# EAGLE design Flex2019V1 (EAGLE 9.2.2)
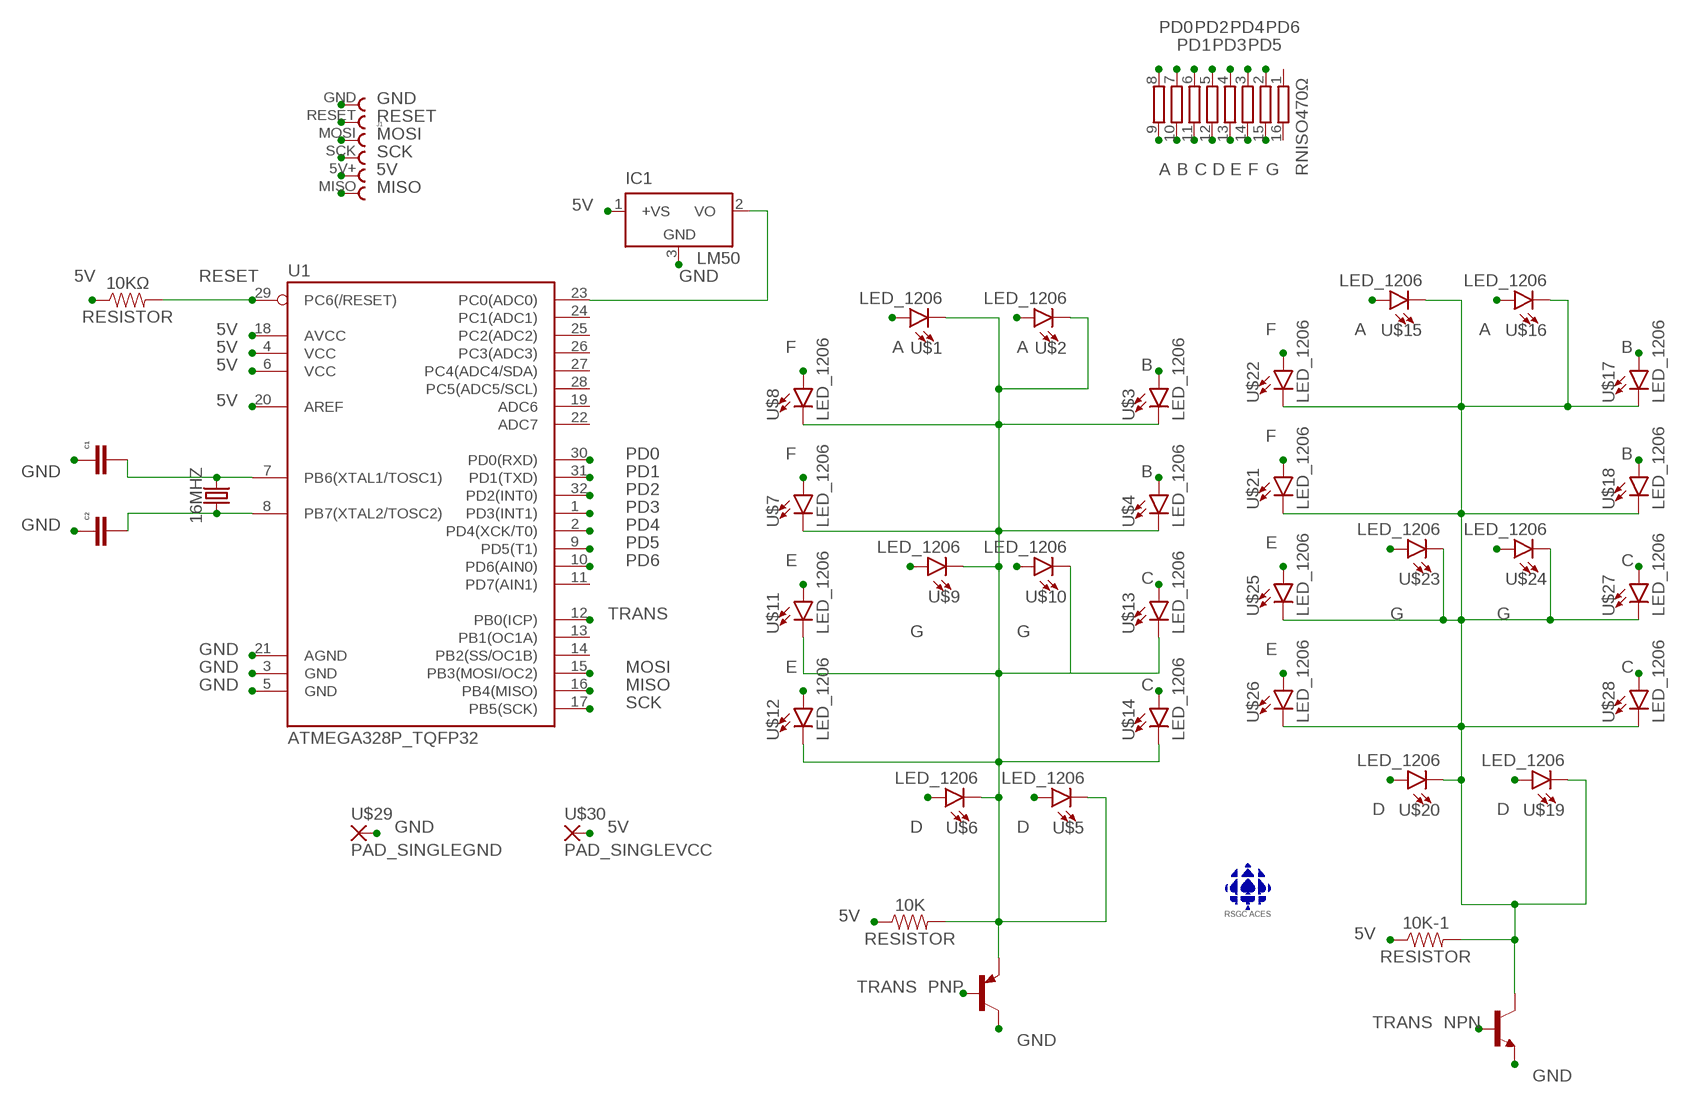
[diagram p0: schematic, sheet 1]

## Parts
10K  RESISTOR  [R1206]
10K-1  RESISTOR  [R1206]
10KΩ  RESISTOR  [R1206]
16MHZ  CRYSTALSMD-5X3.2-2PAD  [CRYSTAL-SMD-5X3.2-2PAD]
C1  CAPACITOR_1206_NONPPOLAR  [C1206]
C2  CAPACITOR_1206_NONPPOLAR  [C1206]
IC1  LM50  [SOT23]
J1  CONN_FPC_ISPCONNECTOR_PADS  [68610614122]
NPN  -NPN-SOT23-BEC  [SOT23-BEC]
PNP  -PNP-SOT23-BEC  [SOT23-BEC]
RNISO470Ω  RESISTOR_NETWORK  [4816P]
U1  ATMEGA328P_TQFP32  [TQFP32-08]
U$1  LED_1206  [CHIPLED_1206]
U$2  LED_1206  [CHIPLED_1206]
U$3  LED_1206  [CHIPLED_1206]
U$4  LED_1206  [CHIPLED_1206]
U$5  LED_1206  [CHIPLED_1206]
U$6  LED_1206  [CHIPLED_1206]
U$7  LED_1206  [CHIPLED_1206]
U$8  LED_1206  [CHIPLED_1206]
U$9  LED_1206  [CHIPLED_1206]
U$10  LED_1206  [CHIPLED_1206]
U$11  LED_1206  [CHIPLED_1206]
U$12  LED_1206  [CHIPLED_1206]
U$13  LED_1206  [CHIPLED_1206]
U$14  LED_1206  [CHIPLED_1206]
U$15  LED_1206  [CHIPLED_1206]
U$16  LED_1206  [CHIPLED_1206]
U$17  LED_1206  [CHIPLED_1206]
U$18  LED_1206  [CHIPLED_1206]
U$19  LED_1206  [CHIPLED_1206]
U$20  LED_1206  [CHIPLED_1206]
U$21  LED_1206  [CHIPLED_1206]
U$22  LED_1206  [CHIPLED_1206]
U$23  LED_1206  [CHIPLED_1206]
U$24  LED_1206  [CHIPLED_1206]
U$25  LED_1206  [CHIPLED_1206]
U$26  LED_1206  [CHIPLED_1206]
U$27  LED_1206  [CHIPLED_1206]
U$28  LED_1206  [CHIPLED_1206]
U$29  PAD_SINGLEGND  [PAD_GND]
U$30  PAD_SINGLEVCC  [PAD_VCC]
U$31  ACES_LOGO  [ACES_LOGO]

## Nets
5V: 10K-1.1 10K.1 10KΩ.1 IC1.1(+VS) J1.5V+ U1.4(VCC) U1.6(VCC) U1.18(AVCC) U1.20(AREF) U$30.1(P)
A: RNISO470Ω.9 U$1.A U$2.A U$15.A U$16.A
B: RNISO470Ω.10 U$3.A U$4.A U$17.A U$18.A
C: RNISO470Ω.11 U$13.A U$14.A U$27.A U$28.A
D: RNISO470Ω.12 U$5.A U$6.A U$19.A U$20.A
E: RNISO470Ω.13 U$11.A U$12.A U$25.A U$26.A
F: RNISO470Ω.14 U$7.A U$8.A U$21.A U$22.A
G: RNISO470Ω.15 U$9.A U$10.A U$23.A U$24.A
GND: C1.1 C2.1 IC1.3(GND) J1.GND NPN.E PNP.C U1.3(GND) U1.5(GND) U1.21(AGND) U$29.1(P)
MISO: J1.MISO U1.16(PB4(MISO))
MOSI: J1.MOSI U1.15(PB3(MOSI/OC2))
N$1: IC1.2(VO) U1.23(PC0(ADC0))
N$2: 16MHZ.P$2 C1.2 U1.7(PB6(XTAL1/TOSC1))
N$3: 16MHZ.P$1 C2.2 U1.8(PB7(XTAL2/TOSC2))
N$4: 10K.2 PNP.E U$1.C U$2.C U$3.C U$4.C U$5.C U$6.C U$7.C U$8.C U$9.C U$10.C U$11.C U$12.C U$13.C U$14.C
N$5: 10K-1.2 NPN.C U$15.C U$16.C U$17.C U$18.C U$19.C U$20.C U$21.C U$22.C U$23.C U$24.C U$25.C U$26.C U$27.C U$28.C
PD0: RNISO470Ω.8 U1.30(PD0(RXD))
PD1: RNISO470Ω.7 U1.31(PD1(TXD))
PD2: RNISO470Ω.6 U1.32(PD2(INT0))
PD3: RNISO470Ω.5 U1.1(PD3(INT1))
PD4: RNISO470Ω.4 U1.2(PD4(XCK/T0))
PD5: RNISO470Ω.3 U1.9(PD5(T1))
PD6: RNISO470Ω.2 U1.10(PD6(AIN0))
RESET: 10KΩ.2 J1.RESET U1.29(PC6(/RESET))
SCK: J1.SCK U1.17(PB5(SCK))
TRANS: NPN.B PNP.B U1.12(PB0(ICP))
Unconnected: RNISO470Ω.1 RNISO470Ω.16 U1.11(PD7(AIN1)) U1.13(PB1(OC1A)) U1.14(PB2(SS/OC1B)) U1.19(ADC6) U1.22(ADC7) U1.24(PC1(ADC1)) U1.25(PC2(ADC2)) U1.26(PC3(ADC3)) U1.27(PC4(ADC4/SDA)) U1.28(PC5(ADC5/SCL))

## Library data of the parts
10K 10K-1 10KΩ = ACES_SMT:RESISTOR
16MHZ = SparkFun-Clocks:CRYSTAL: Crystals (Generic) These are passive quartz crystals, which can be used as a clock source for a microcontroller. Crystal's are two-terminal devices. They require external "load" capacitors to generate an oscillating signal.
C1 C2 = ACES_SMT:CAPACITOR_1206_NONPPOLAR
IC1 = linear:LM50: SOT-23 Single-Supply Centigrade Temperature Sensor Vout = (10mV/°C x Temp °C) +5mmmV Source: http://cache.national.com/ds/LM/LM50.pdf
J1 = ACES_SMT:CONN_FPC_ISP: WR-FPC 1.00mm SMT ZIF Horizontal Top Contact, 6 Pins=>Code : Con_FPC_ZIF_1.00_68610614122 <http://katalog.we-online.de/media/images/eican/Con_FPC_ZIF_1.00_6861xx14122_pf2.jpg> Details see: http://katalog.we-online.de/en/em/686_1xx_141_22 Created 2014-07-09, Karrer Zheng 2014 (C) Würth Elektronik
NPN = DC_LOAD_AU:*-NPN-: NPN Transistror BF959 corrected 2008.03.06
PNP = DC_LOAD_AU:*-PNP-: PNP Transistror
RNISO470Ω = ACES_SMT:RESISTOR_NETWORK: BOURNS RESISTOR NETWORK; MF: BOURNS, INC.; MPN: 4816P-T01-684LF; OC_FARNELL: 9357483; OC_NEWARK: 33K0707
U1 = ACES_SMT:ATMEGA328P_TQFP32: Popular 328P in QFP Storefront component: ATmega328 - TQFP <https://www.sparkfun.com/products/13448> (COM-13448) Datasheet <http://www.sparkfun.com/datasheets/Components/SMD/ATMega328.pdf> SparkFun Products SparkFun RedBoard - Programmed with Arduino <https://www.sparkfun.com/products/12757> (DEV-12757) Arduino Pro Mini 328 - 5V/16MHz <https://www.sparkfun.com/products/11113> (DEV-11113) Arduino Pro Mini 328 - 3.3V/8MHz <https://www.sparkfun.com/products/11114> (DEV-11114) SparkFun OpenLog <https://www.sparkfun.com/products/13712> (DEV-13712) SparkFun MicroView - OLED Arduino Module <https://www.sparkfun.com/products/12923> (DEV-12923) SparkFun Digital Sandbox <https://www.sparkfun.com/products/12651> (DEV-12651) SparkFun PicoBoard <https://www.sparkfun.com/products/11888> (WIG-11888) Arduino Fio <https://www.sparkfun.com/products/10116> (DEV-10116) LilyPad Arduino 328 Main Board <https://www.sparkfun.com/products/13342> (DEV-13342) SparkFun RedStick <https://www.sparkfun.com/products/13741> (DEV-13741) LilyPad MP3 <https://www.sparkfun.com/products/11013> (DEV-11013) LilyPad Arduino SimpleSnap <https://www.sparkfun.com/products/10941> (DEV-10941) SparkFun Stepoko <https://www.sparkfun.com/products/13899> (ROB-13899) SparkFun Geiger Counter <https://www.sparkfun.com/products/11345> (SEN-11345) SparkFun EL Sequencer <https://www.sparkfun.com/products/12781> (COM-12781) Arduino Pro 328 - 5V/16MHz <https://www.sparkfun.com/products/10915> (DEV-10915) CryptoCape <https://www.sparkfun.com/products/12773> (DEV-12773) SparkFun IR Thermometer Evaluation Board - MLX90614 <https://www.sparkfun.com/products/10740> (SEN-10740) SparkFun RedBot Mainboard <https://www.sparkfun.com/products/12097> (ROB-12097) Arduino Pro 328 - 3.3V/8MHz <https://www.sparkfun.com/products/10914> (DEV-10914) SparkFun Block for Intel® Edison - Arduino <https://www.sparkfun.com/products/13036> (DEV-13036) SparkFun Simon Says - Surface Mount Soldering Kit <https://www.sparkfun.com/products/10935> (KIT-10935) SparkFun 7-Segment Serial Display - Red <https://www.sparkfun.com/products/11441> (COM-11441) SparkFun 7-Segment Serial Display - White <https://www.sparkfun.com/products/11629> (COM-11629) SparkFun 7-Segment Serial Display - Yellow <https://www.sparkfun.com/products/11443> (COM-11443) SparkFun 7-Segment Serial Display - Kelly Green <https://www.sparkfun.com/products/11440> (COM-11440) SparkFun 7-Segment Serial Display - Blue <https://www.sparkfun.com/products/11442> (COM-11442) SparkFun OpenSegment Serial Display - 20mm (Blue) <https://www.sparkfun.com/products/11647> (COM-11647) SparkFun OpenSegment Serial Display - 20mm (Green) <https://www.sparkfun.com/products/11646> (COM-11646) SparkFun OpenSegment Serial Display - 20mm (White) <https://www.sparkfun.com/products/11648> (COM-11648) SparkFun OpenSegment Serial Display - 20mm (Red) <https://www.sparkfun.com/products/11644> (COM-11644) SparkFun OpenSegment Serial Display - 20mm (Yellow) <https://www.sparkfun.com/products/11645> (COM-11645) SparkFun OpenSegment Shield <https://www.sparkfun.com/products/13190> (DEV-13190)
U$1-U$28 = ACES_SMT:LED_1206
U$29 U$30 = ACES_SMT:PAD_SINGLE
U$31 = ACES_SMT:ACES_LOGO

## Board
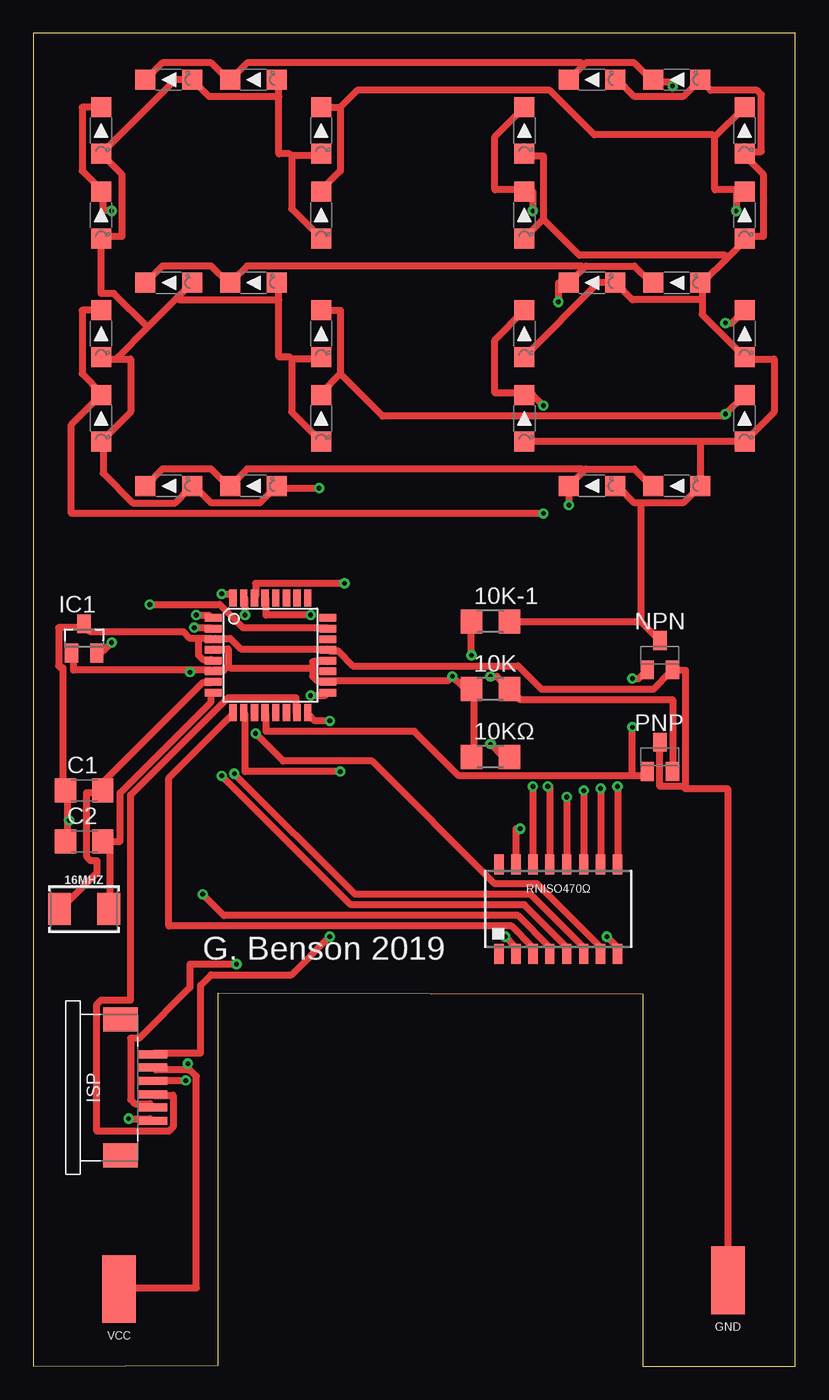
[diagram p1: board, top side]
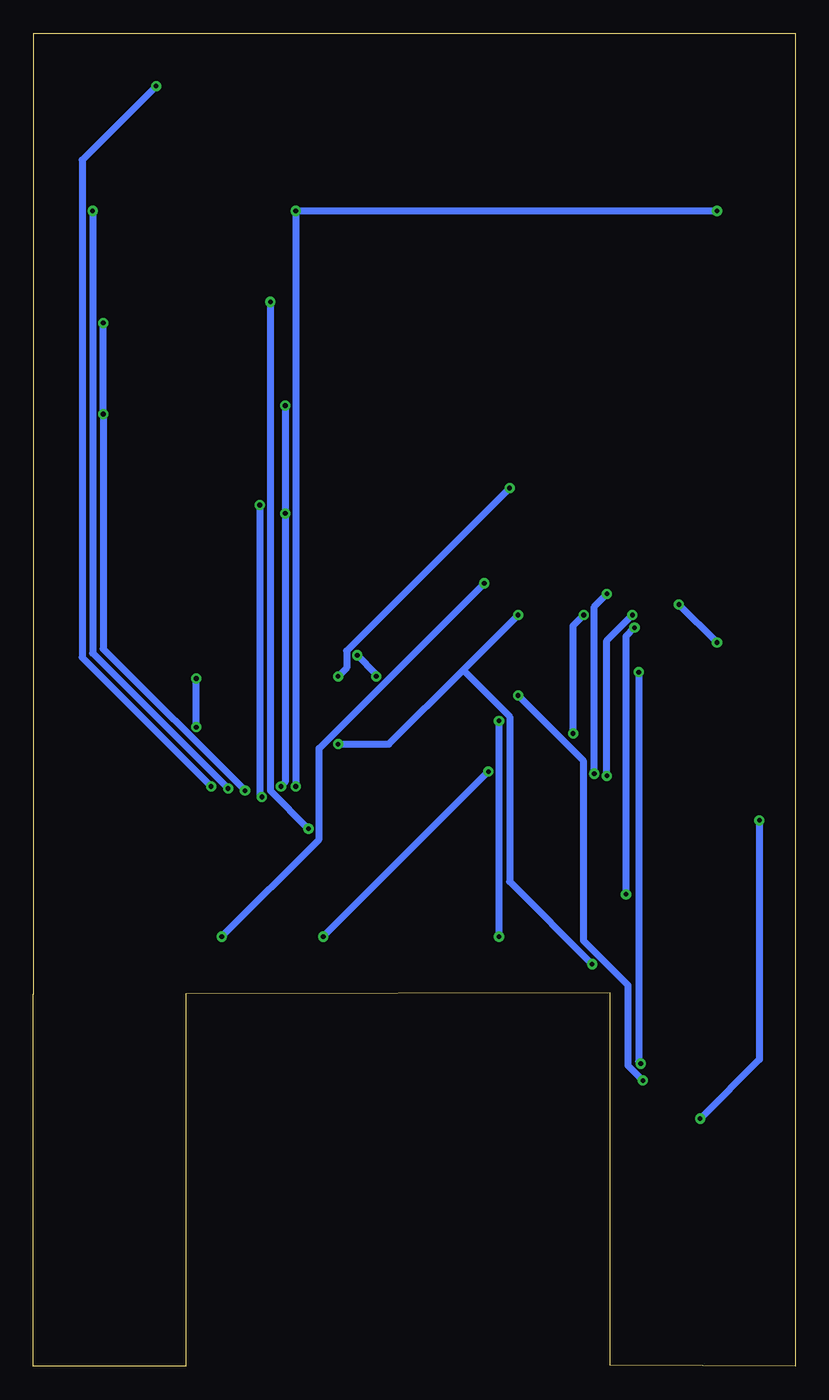
[diagram p2: board, bottom side, seen from below]

Size 57.15 x 100 mm. Coordinates in mm from the lower left corner, seen from the top.
Outline: 0,100 0,0 13.87,0.08 13.87,28.02 45.72,27.94 45.72,0 57.15,0 57.15,27.94 57.13,27.94 57.13,100 0,100
Copper layers (1*16): Top 0.035mm / dielectric 1.5mm / Bottom 0.035mm
Design rules "default *": minimum track width 20mil, minimum drill 0.35mm, track to track 6mil, track to pad 6mil, pad to pad 6mil, via to via 6mil, smd to smd 6mil, copper to edge 40mil, drill to drill 6mil, minimum pad ring 10mil, minimum via ring 8mil, stop-mask expansion 4mil, vias tented up to drill 0mil, thermal gap 10mil

### Footprints (pad centres in the part's own frame; a part is rotated, then mirrored left to right if it is on the bottom)
R1206 = smd 1.6 x 1.803: 1 -1.422,0; 2 1.422,0
CRYSTAL-SMD-5X3.2-2PAD = smd 1.7 x 2.4: P$1 1.85,0; P$2 -1.85,0
C1206 = smd 1.6 x 1.8: 1 -1.4,0; 2 1.4,0
SOT23 = smd 1 x 1.4: 1 -0.95,-1.1; 2 0.95,-1.1; 3 0,1.1
68610614122 = smd 2.2 x 0.6: 5V+ -2.4,-1.5; GND -2.4,2.5; MISO -2.4,-2.5; MOSI -2.4,0.5; RESET -2.4,1.5; SCK -2.4,-0.5 | smd 2.6 x 1.8: Z1 0,-5.1; Z2 0,5.1
SOT23-BEC = smd 1 x 1.4: B -0.95,-1.1; C 0,1.1; E 0.95,-1.1
4816P = smd 0.7 x 1.5: 1 -4.445,-3.346; 2 -3.175,-3.346; 3 -1.905,-3.346; 4 -0.635,-3.346; 5 0.635,-3.346; 6 1.905,-3.346; 7 3.175,-3.346; 8 4.445,-3.346; 9 4.445,3.346; 10 3.175,3.346; 11 1.905,3.346; 12 0.635,3.346; 13 -0.635,3.346; 14 -1.905,3.346; 15 -3.175,3.346; 16 -4.445,3.346
TQFP32-08 = smd 1.27 x 0.559: 1 -4.293,2.8; 2 -4.293,2; 3 -4.293,1.2; 4 -4.293,0.4; 5 -4.293,-0.4; 6 -4.293,-1.2; 7 -4.293,-2; 8 -4.293,-2.8; 17 4.293,-2.8; 18 4.293,-2; 19 4.293,-1.2; 20 4.293,-0.4; 21 4.293,0.4; 22 4.293,1.2; 23 4.293,2; 24 4.293,2.8 | smd 0.559 x 1.27: 9 -2.8,-4.293; 10 -2,-4.293; 11 -1.2,-4.293; 12 -0.4,-4.293; 13 0.4,-4.293; 14 1.2,-4.293; 15 2,-4.293; 16 2.8,-4.293; 25 2.8,4.293; 26 2,4.293; 27 1.2,4.293; 28 0.4,4.293; 29 -0.4,4.293; 30 -1.2,4.293; 31 -2,4.293; 32 -2.8,4.293
CHIPLED_1206 = smd 1.5 x 1.5: A 1.75,0; C -1.75,0
PAD_GND = smd 2.54 x 5.08: 1 0,0
PAD_VCC = smd 2.54 x 5.08: 1 0,0

### Placement (x,y rotation side)
10K  34.29,50.8 0 top
10K-1  34.29,55.88 0 top
10KΩ  34.29,45.72 0 top
16MHZ  3.81,34.29 0 top
C1  3.81,43.18 0 top
C2  3.81,39.37 0 top
IC1  3.81,54.61 0 top
J1  6.53,20.9 180 top
NPN  46.99,53.34 0 top
PNP  46.99,45.72 0 top
RNISO470Ω  39.37,34.29 0 top
U1  17.78,53.34 0 top
U$1  10.16,96.52 180 top
U$2  16.51,96.52 180 top
U$3  21.59,92.71 90 top
U$4  21.59,86.36 90 top
U$5  16.51,66.04 180 top
U$6  10.16,66.04 180 top
U$7  5.08,86.36 90 top
U$8  5.08,92.71 90 top
U$9  10.16,81.28 180 top
U$10  16.51,81.28 180 top
U$11  5.08,77.47 90 top
U$12  5.08,71.12 90 top
U$13  21.59,77.47 90 top
U$14  21.59,71.12 90 top
U$15  41.91,96.52 180 top
U$16  48.26,96.52 180 top
U$17  53.34,92.71 90 top
U$18  53.34,86.36 90 top
U$19  48.26,66.04 180 top
U$20  41.91,66.04 180 top
U$21  36.83,86.36 90 top
U$22  36.83,92.71 90 top
U$23  41.91,81.28 180 top
U$24  48.26,81.28 180 top
U$25  36.83,77.47 90 top
U$26  36.83,71.12 90 top
U$27  53.34,77.47 90 top
U$28  53.34,71.12 90 top
U$29  52.1,6.45 0 top
U$30  6.43,5.79 0 top
U$31  20.32,39.37 0 top

### Tracks (layer width: path | path; a pad name or v marks a point on that pad's centre or on a via)
5V  (via drill 0.35)
  Top 0.508: 11.59,22.22 11.75,22.22 12.22,21.75 12.22,5.87 6.51,5.87 U$30.1 | 11.59,22.22 9.21,22.22 9.05,22.38 J1.5V+ | 10KΩ.1 33.02,45.72 33.02,50.8 10K.1 32.7,50.96 32.23,50.96 v31.43,51.75 31.11,51.44 22.23,51.44 U1.18 22.07,51.44 21.27,51.44 20.95,51.75 20.95,52.39 | v32.86,53.34 10K-1.1 | 20.95,52.39 20.95,52.86 22.07,52.86 U1.20 | 14.61,52.55 14.29,52.23 13.49,52.23 U1.6 13.34,52.23 11.75,52.23 | 14.61,52.55 14.61,53.82 13.49,53.82 U1.4 | 11.75,52.23 3.02,52.23 3.02,53.5 IC1.1 | 20.95,52.39 14.76,52.39 14.61,52.55 | v11.59,22.7 11.59,22.22 | v11.75,52.07 11.75,52.23
  Bottom 0.508: v32.86,53.34 31.43,51.91 v31.43,51.75 | v11.59,22.7 11.75,22.86 v11.75,52.07
A  (via drill 0.35)
  Top 0.508: U$1.A 9.68,97.79 13.34,97.79 14.61,96.52 U$2.A 14.92,96.68 16.03,97.79 41.12,97.79 41.27,97.63 | 41.27,97.63 41.43,97.79 45.09,97.79 46.35,96.52 U$16.A 46.67,96.36 47.62,96.36 v47.94,96.04 | 41.27,97.63 U$15.A | v43.81,43.5 RNISO470Ω.9
  Bottom 0.508: v43.81,43.5 53.5,53.18 53.5,90.49 v47.94,96.04
B  (via drill 0.35)
  Top 0.508: 23.02,94.46 23.02,89.69 21.59,88.27 U$4.A | 23.02,94.46 U$3.A | v42.55,43.34 RNISO470Ω.10 | 52.7,88.11 v52.7,86.68 | 52.7,88.11 U$18.A | 51.12,92.23 U$17.A | 51.12,92.23 51.12,88.27 52.55,88.27 52.7,88.11 | 23.02,94.46 24.29,95.73 38.73,95.73 42.07,92.39 50.96,92.39 51.12,92.23
  Bottom 0.508: v42.55,43.34 52.7,53.5 v52.7,86.68
C  (via drill 0.35)
  Top 0.508: 23.02,74.45 21.59,73.02 U$14.A | 23.02,74.45 23.02,79.22 U$13.A | v41.27,43.18 RNISO470Ω.11 | U$28.A v51.91,71.44 51.75,71.28 26.19,71.28 23.02,74.45 | v51.91,78.26 52.39,78.26 U$27.A
  Bottom 0.508: v41.27,43.18 51.91,53.82 v51.91,71.44 v51.91,78.26
D  (via drill 0.35)
  Top 0.508: U$6.A 9.68,67.31 13.34,67.31 14.61,66.04 U$5.A 14.92,66.2 16.03,67.31 41.12,67.31 41.27,67.15 | v40.01,42.7 RNISO470Ω.12 | v40.16,64.61 U$20.A 40.32,66.2 41.27,67.15 | 41.27,67.15 41.43,67.31 45.09,67.31 46.35,66.04 U$19.A
  Bottom 0.508: v40.01,42.7 40.16,42.86 v40.16,64.61
E  (via drill 0.35)
  Top 0.508: U$11.A 3.65,79.22 3.65,74.45 5.08,73.02 U$12.A 4.92,72.71 2.86,70.64 2.86,63.98 v38.26,63.98 | RNISO470Ω.13 38.73,43.5 v38.58,43.5 | v38.26,72.07 37.47,72.87 U$26.A 36.67,73.02 34.61,73.02 34.61,76.99 U$25.A
  Bottom 0.508: v38.58,43.5 38.26,43.82 v38.26,63.98 v38.26,72.07
F  (via drill 0.35)
  Top 0.508: U$8.A 3.65,94.46 3.65,89.69 5.08,88.27 U$7.A 5.24,87.95 5.24,86.68 v5.87,86.68 | v37.47,43.5 RNISO470Ω.14 | v37.47,86.68 37.47,88.11 U$21.A 36.67,88.27 34.61,88.27 34.61,92.23 U$22.A
  Bottom 0.508: v37.47,43.5 v37.47,86.68 v5.87,86.68
G  (via drill 0.35)
  Top 0.508: U$9.A 9.68,82.55 13.34,82.55 14.61,81.28 U$10.A 14.92,81.44 16.03,82.55 41.12,82.55 41.27,82.39 | RNISO470Ω.15 36.2,40.32 v36.51,40.32 | v39.37,79.85 39.37,81.28 U$23.A 40.32,81.44 41.27,82.39 | 41.27,82.39 41.43,82.55 45.09,82.55 46.35,81.28 U$24.A
  Bottom 0.508: v36.51,40.32 39.37,43.18 v39.37,79.85
GND  (via drill 0.35)
  Top 0.508: 2.54,40.96 2.54,43.18 C1.1 2.22,43.34 2.22,52.39 2.06,52.39 1.91,52.55 1.91,55.4 3.65,55.4 IC1.3 3.81,55.56 4.29,55.09 11.27,55.09 11.75,54.61 12.38,54.61 | 2.54,40.96 2.54,39.37 C2.1 | v7.14,18.57 8.73,18.57 8.89,18.41 J1.GND | v2.7,40.96 2.54,40.96 | PNP.C 46.99,43.5 48.74,43.5 | 48.74,43.5 48.9,43.66 48.9,52.23 NPN.E 47.78,52.07 46.51,50.8 38.1,50.8 36.35,52.55 23.97,52.55 22.86,53.66 22.23,53.66 U1.21 22.07,53.82 15.56,53.82 14.76,54.61 13.65,54.61 U1.3 13.34,54.61 12.38,54.61 | 12.38,54.61 12.38,53.34 12.7,53.02 13.34,53.02 U1.5 | U$29.1 52.07,6.51 52.07,43.34 48.9,43.34 48.74,43.5
  Bottom 0.508: v7.14,18.57 2.7,23.02 v2.7,40.96
MISO  (via drill 0.35)
  Top 0.508: v22.23,48.42 21.11,48.42 20.64,48.9 U1.16 | v22.23,32.23 19.37,29.37 13.34,29.37 12.54,28.57 12.54,23.5 9.05,23.5 J1.MISO
  Bottom 0.508: v22.23,32.23 v22.23,48.42
MOSI
  Top 0.508: U1.15 19.68,49.05 19.68,50.17 14.61,50.17 7.3,42.86 7.3,27.46 5.08,27.46 4.76,27.15 4.76,17.62 10.16,17.62 10.48,17.94 10.48,20.32 9.05,20.32 J1.MOSI
N$1  (via drill 0.35)
  Top 0.508: v8.73,57.15 13.97,57.15 15.72,55.4 22.07,55.4 U1.23 | v5.87,54.29 5.24,53.66 4.76,53.66 IC1.2
  Bottom 0.508: v5.87,54.29 v8.73,57.15
N$2
  Top 0.508: U1.7 13.34,51.28 12.7,51.28 5.24,43.82 5.24,43.18 C1.2 5.08,43.02 3.97,43.02 3.97,38.26 4.29,37.94 4.76,37.94 4.76,36.99 2.06,34.29 16MHZ.P$2
N$3
  Top 0.508: U1.8 13.34,50.48 13.34,49.85 6.51,43.02 6.51,39.37 C2.2 5.71,39.21 5.71,34.29 16MHZ.P$1
N$4  (via drill 0.35)
  Top 0.508: 19.37,90.8 19.37,86.84 U$4.C | 19.37,90.8 21.59,90.8 U$3.C | 18.41,95.25 18.41,90.96 19.21,90.96 19.37,90.8 | 18.41,95.25 18.41,96.52 U$2.C | 18.41,95.25 13.18,95.25 12.06,96.36 U$1.C 10.64,96.52 U$8.C 5.24,90.8 6.67,89.38 6.67,84.77 5.24,84.77 U$7.C 5.08,80.49 6.03,80.49 8.57,77.95 | PNP.E 47.94,44.77 47.94,50.01 36.51,50.01 10K.2 35.56,50.96 34.77,51.75 v34.29,51.75 | 19.37,75.56 19.37,71.6 U$14.C | 19.37,75.56 21.59,75.56 U$13.C | 18.41,80.01 18.41,75.72 19.21,75.72 19.37,75.56 | 18.41,80.01 18.41,81.28 U$10.C | 6.35,75.56 5.08,75.56 U$11.C | 6.35,75.56 7.3,75.56 7.3,71.6 U$12.C 5.24,69.21 5.24,66.99 7.46,64.77 10.64,64.77 11.75,65.88 U$6.C 12.06,66.04 13.34,64.77 16.99,64.77 U$5.C 18.41,65.88 v21.43,65.88 | 8.57,77.95 6.35,75.72 6.35,75.56 | 8.57,77.95 10.79,80.17 | 10.79,80.17 U$9.C | 18.41,80.01 10.95,80.01 10.79,80.17
  Bottom 0.508: v34.29,51.75 33.66,52.39 33.66,53.66 v21.43,65.88
N$5
  Top 0.508: 45.56,55.88 NPN.C | 10K-1.2 45.56,55.88 | 45.56,64.77 48.74,64.77 U$19.C 50.01,66.2 50.01,69.37 | 45.56,64.77 45.09,64.77 43.81,66.04 U$20.C | 50.01,69.37 U$28.C 53.5,69.53 55.56,71.6 55.56,75.56 53.5,75.56 U$27.C 50.16,78.9 50.16,80.01 | 50.01,69.37 U$26.C | 45.56,64.77 45.56,55.88 | U$25.C 42.39,81.28 U$23.C 43.81,81.12 44.93,80.01 50.16,80.01 | 38.26,86.04 U$21.C | 38.26,86.04 38.26,90.8 36.83,90.8 U$22.C | U$15.C 43.81,96.52 45.09,95.25 48.74,95.25 U$16.C 50.16,96.36 50.8,95.73 54.29,95.73 54.61,95.41 54.61,91.12 53.5,91.12 U$17.C 53.34,90.8 54.77,89.38 54.77,84.77 53.5,84.77 U$18.C 53.34,84.45 52.07,83.19 | 50.16,80.01 50.16,81.28 U$24.C 50.32,81.44 52.07,83.19 | 38.26,86.04 40.96,83.34 51.91,83.34 52.07,83.19
PD0  (via drill 0.35)
  Top 0.508: v23.34,58.74 16.67,58.74 16.67,57.79 U1.30 | v43.02,32.23 43.81,31.43 RNISO470Ω.8
  Bottom 0.508: v23.34,58.74 35.72,46.36 35.72,39.53 v43.02,32.23
PD1  (via drill 0.35)
  Top 0.508: v15.88,56.36 15.88,57.63 U1.31 | v16.67,47.47 18.73,45.4 25.4,45.4 34.61,36.2 37.78,36.2 42.55,31.43 RNISO470Ω.7
  Bottom 0.508: v15.88,56.36 16.67,55.56 v16.67,47.47
PD2  (via drill 0.35)
  Top 0.508: v14.13,57.94 14.76,57.94 14.92,57.79 U1.32 | v15.08,44.45 24.13,35.4 37.31,35.4 41.27,31.43 RNISO470Ω.6
  Bottom 0.508: v14.13,57.94 15.08,56.99 v15.08,44.45
PD3  (via drill 0.35)
  Top 0.508: v12.22,56.36 13.18,56.36 13.34,56.2 U1.1 | v14.13,44.29 23.81,34.61 36.83,34.61 40.01,31.43 RNISO470Ω.5
  Bottom 0.508: v12.22,56.36 14.13,54.45 v14.13,44.29
PD4  (via drill 0.35)
  Top 0.508: v12.06,55.4 13.34,55.4 U1.2 | v12.7,35.4 14.29,33.81 36.35,33.81 38.73,31.43 RNISO470Ω.4
  Bottom 0.508: v12.06,55.4 12.7,54.77 v12.7,35.4
PD5
  Top 0.508: RNISO470Ω.3 37.47,31.43 35.88,33.02 10.16,33.02 10.16,44.13 14.92,48.9 U1.9
PD6  (via drill 0.35)
  Top 0.508: v23.02,44.61 15.88,44.61 15.88,48.9 U1.10 | v35.4,32.23 36.2,31.43 RNISO470Ω.2
  Bottom 0.508: v35.4,32.23 v23.02,44.61
RESET  (via drill 0.35)
  Top 0.508: v20.8,56.36 17.46,56.36 17.46,57.63 U1.29 | v34.29,46.67 35.24,45.72 10KΩ.2 | v15.24,30.16 11.75,30.16 11.75,28.42 7.94,24.61 7.3,24.61 7.3,20 7.62,19.68 8.73,19.68 8.89,19.53 J1.RESET
  Bottom 0.508: 24.92,52.23 30.48,46.67 v34.29,46.67 | 24.92,52.23 v20.8,56.36 | v15.24,30.16 21.43,36.35 21.43,48.74 24.92,52.23
SCK  (via drill 0.35)
  Top 0.508: v20.8,50.32 21.91,50.32 22.07,50.48 U1.17 | v11.43,21.43 9.05,21.43 J1.SCK
  Bottom 0.508: v20.8,50.32 15.88,45.4 15.88,31.91 12.54,28.57 12.54,22.54 v11.43,21.43
TRANS  (via drill 0.35)
  Top 0.508: 44.93,44.29 45.72,44.29 46.04,44.61 PNP.B | 44.93,44.29 31.91,44.29 28.57,47.62 17.46,47.62 17.46,48.9 U1.12 | v44.93,51.59 45.4,51.59 NPN.B | 44.93,44.29 v44.93,47.94
  Bottom 0.508: v44.93,47.94 v44.93,51.59

### Text on the board
tNames: G. Benson 2019